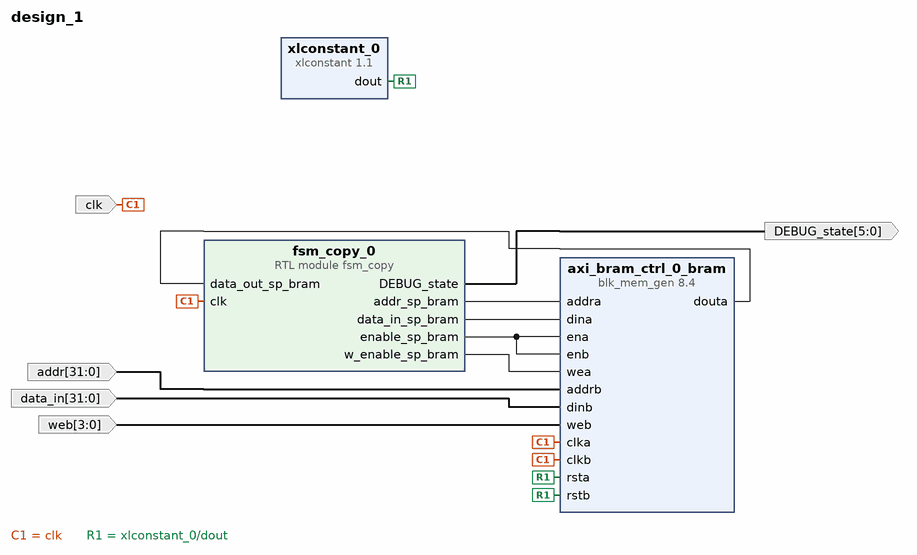
[diagram p0: block diagram of the top level]
# Vivado block design design_1, xc7z020clg400-1, Vivado 2023.1
create_bd_design design_1

create_bd_port -dir I clk
create_bd_port -dir I -from 31 -to 0 addr
create_bd_port -dir I -from 31 -to 0 data_in
create_bd_port -dir I -from 3 -to 0 web
create_bd_port -dir O -from 5 -to 0 DEBUG_state

create_bd_cell -type ip -vlnv xilinx.com:ip:blk_mem_gen:8.4 axi_bram_ctrl_0_bram
set_property -dict {CONFIG.Memory_Type True_Dual_Port_RAM} [get_bd_cells axi_bram_ctrl_0_bram]
create_bd_cell -type ip -vlnv xilinx.com:ip:xlconstant:1.1 xlconstant_0
set_property -dict {CONFIG.CONST_VAL 0} [get_bd_cells xlconstant_0]
create_bd_cell -type module -reference fsm_copy fsm_copy_0

# ---- connections ----

connect_bd_net [get_bd_ports addr] [get_bd_pins axi_bram_ctrl_0_bram/addrb]
connect_bd_net [get_bd_pins axi_bram_ctrl_0_bram/douta] [get_bd_pins fsm_copy_0/data_out_sp_bram]
connect_bd_net [get_bd_ports clk] [get_bd_pins axi_bram_ctrl_0_bram/clka] [get_bd_pins axi_bram_ctrl_0_bram/clkb] [get_bd_pins fsm_copy_0/clk]
connect_bd_net [get_bd_ports data_in] [get_bd_pins axi_bram_ctrl_0_bram/dinb]
connect_bd_net [get_bd_pins fsm_copy_0/DEBUG_state] [get_bd_ports DEBUG_state]
connect_bd_net [get_bd_pins fsm_copy_0/addr_sp_bram] [get_bd_pins axi_bram_ctrl_0_bram/addra]
connect_bd_net [get_bd_pins fsm_copy_0/data_in_sp_bram] [get_bd_pins axi_bram_ctrl_0_bram/dina]
connect_bd_net [get_bd_pins fsm_copy_0/enable_sp_bram] [get_bd_pins axi_bram_ctrl_0_bram/ena] [get_bd_pins axi_bram_ctrl_0_bram/enb]
connect_bd_net [get_bd_pins fsm_copy_0/w_enable_sp_bram] [get_bd_pins axi_bram_ctrl_0_bram/wea]
connect_bd_net [get_bd_ports web] [get_bd_pins axi_bram_ctrl_0_bram/web]
connect_bd_net [get_bd_pins xlconstant_0/dout] [get_bd_pins axi_bram_ctrl_0_bram/rsta] [get_bd_pins axi_bram_ctrl_0_bram/rstb]

validate_bd_design
save_bd_design
